# EAGLE design FinalSchematic1.1 (EAGLE 9.6.2)
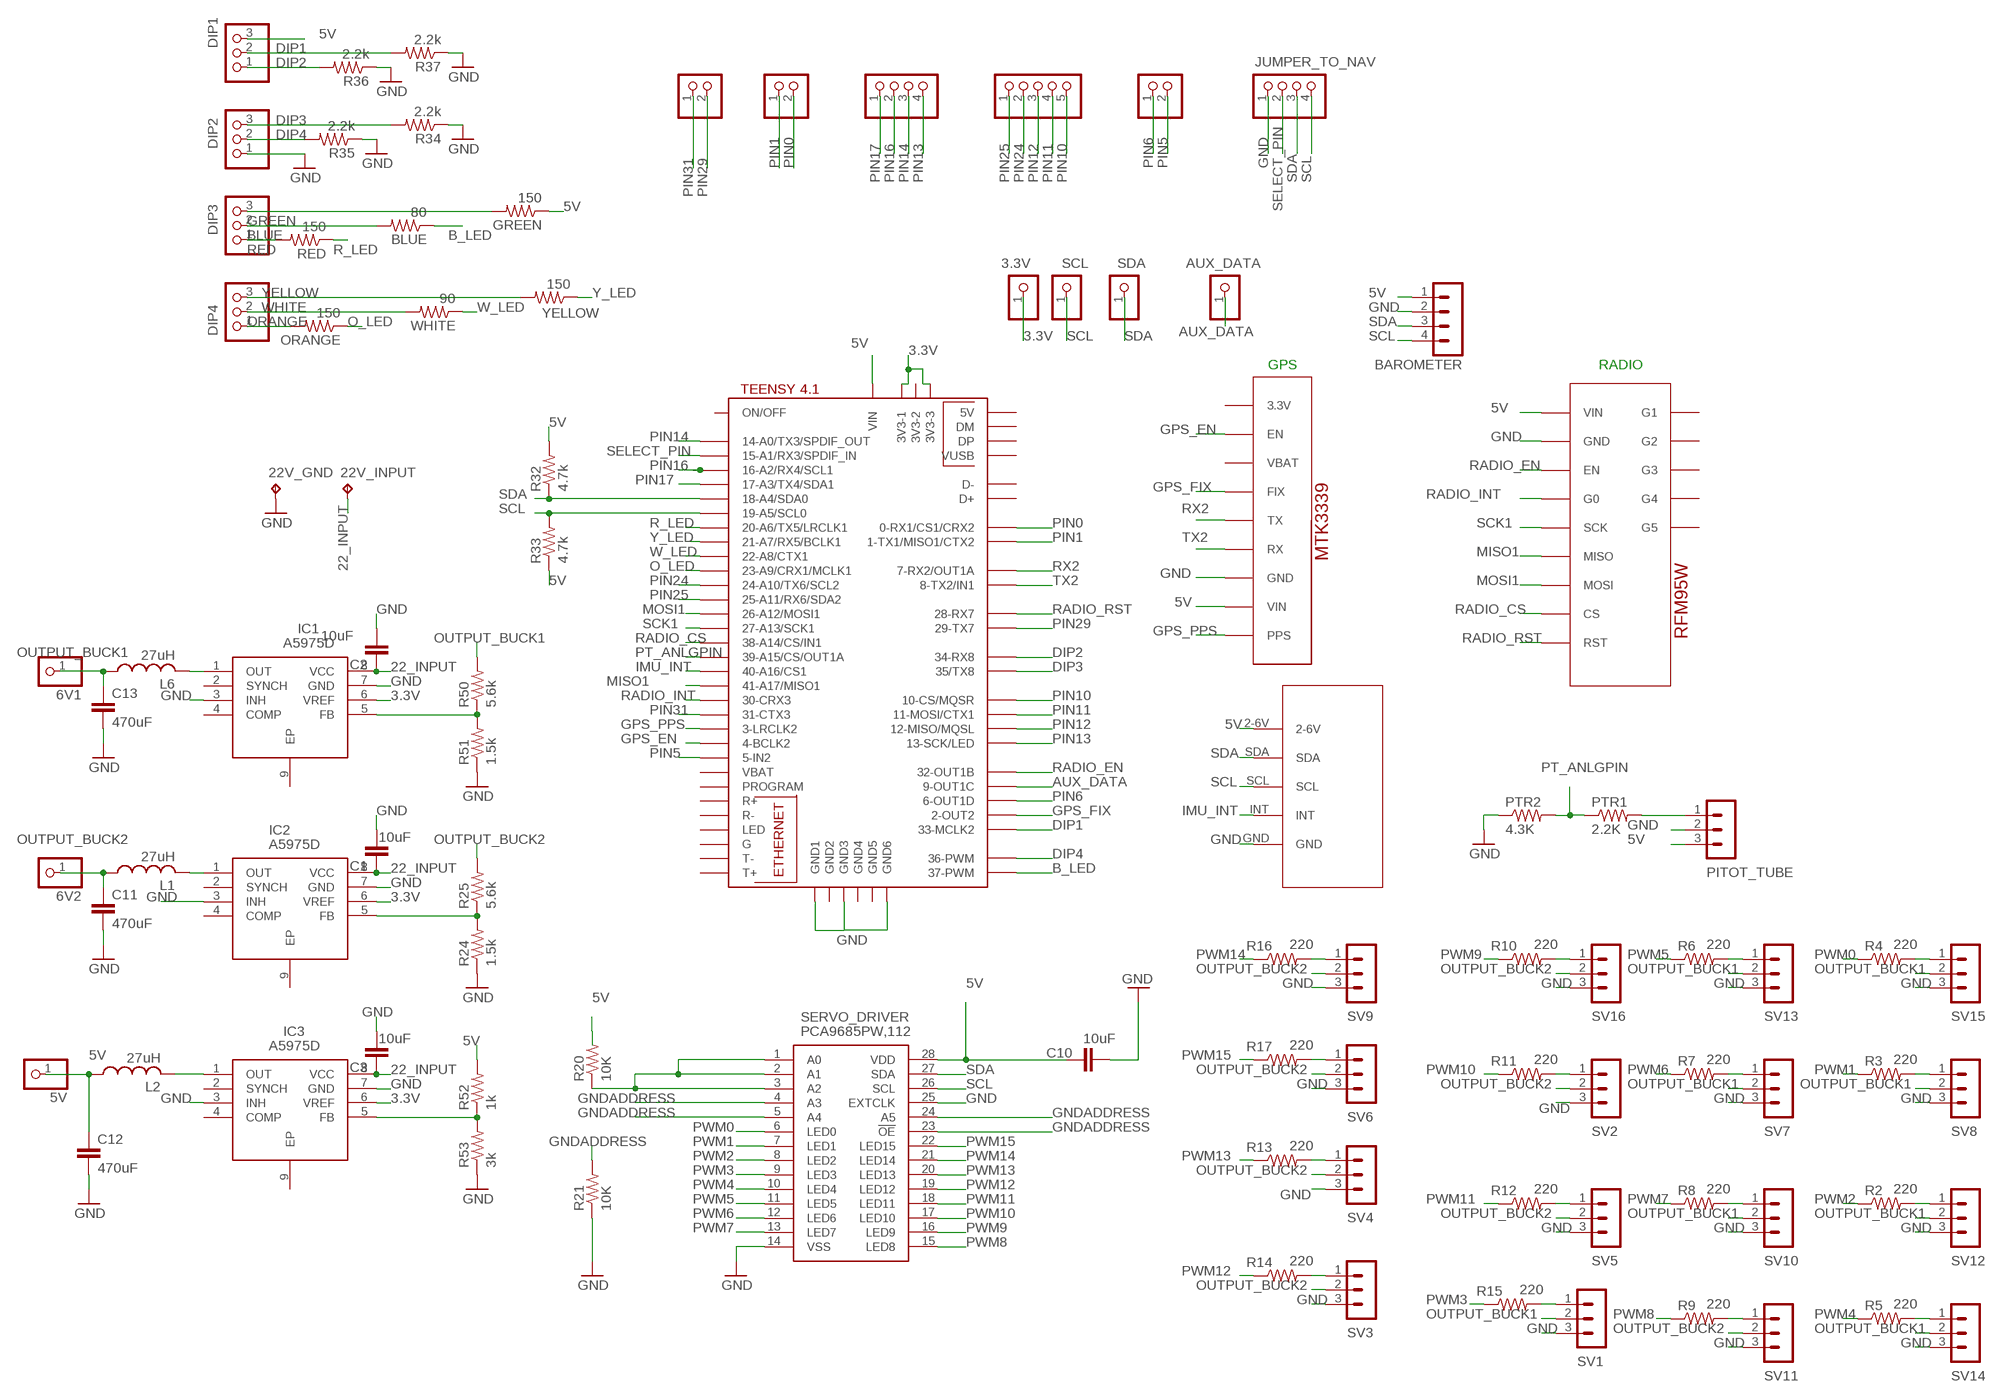
[diagram p0: schematic, sheet 1]

## Parts
1  PINHD-1X2  [1X02]
2  PINHD-1X2  [1X02]
3  PINHD-1X4  [1X04]
3.3V  PINHD-1X1  [1X01]
4  PINHD-1X5  [1X05]
5  PINHD-1X2  [1X02]
5V  PINHD-1X1  [1X01]
6V1  PINHD-1X1  [1X01]
6V2  PINHD-1X1  [1X01]
22V_GND  TPPAD1-17Y  [P1-17Y]
22V_INPUT  TPPAD1-17Y  [P1-17Y]
AUX_DATA  PINHD-1X1  [1X01]
BAROMETER  MA04-1  [MA04-1]
BLUE  80  R-US_0204/7  [0204/7]
C1  10uF  C2,5-3  [C2.5-3]
C2  10uF  C2,5-3  [C2.5-3]
C3  10uF  C2,5-3  [C2.5-3]
C10  10uF  C2,5-3  [C2.5-3]
C11  470uF  C2,5-3  [C2.5-3]
C12  470uF  C2,5-3  [C2.5-3]
C13  470uF  C2,5-3  [C2.5-3]
DIP1  PINHD-1X3  [1X03]
DIP2  PINHD-1X3  [1X03]
DIP3  PINHD-1X3  [1X03]
DIP4  PINHD-1X3  [1X03]
GPSMTK3339  ADAFRUIT_MTK3339_GPS  [ADAFRUIT_MTK3339_GPS]
GREEN  150  R-US_0204/7  [0204/7]
IC1  A5975D  [SOIC127P600X170-9N]
IC2  A5975D  [SOIC127P600X170-9N]
IC3  A5975D  [SOIC127P600X170-9N]
IMU  ICM20948BREAKOUTDEVICE  [ICM20948BREAKOUT]
JUMPER_TO_NAV  PINHD-1X4  [1X04]
L1  27uH  L-USTFI0307  [TFI0307]
L2  27uH  L-USTFI0307  [TFI0307]
L6  27uH  L-USTFI0307  [TFI0307]
ORANGE  150  R-US_0204/7  [0204/7]
PITOT_TUBE  MA03-1  [MA03-1]
PTR1  2.2K  R-US_0204/7  [0204/7]
PTR2  4.3K  R-US_0204/7  [0204/7]
R2  220  R-US_0204/7  [0204/7]
R3  220  R-US_0204/7  [0204/7]
R4  220  R-US_0204/7  [0204/7]
R5  220  R-US_0204/7  [0204/7]
R6  220  R-US_0204/7  [0204/7]
R7  220  R-US_0204/7  [0204/7]
R8  220  R-US_0204/7  [0204/7]
R9  220  R-US_0204/7  [0204/7]
R10  220  R-US_0204/7  [0204/7]
R11  220  R-US_0204/7  [0204/7]
R12  220  R-US_0204/7  [0204/7]
R13  220  R-US_0204/7  [0204/7]
R14  220  R-US_0204/7  [0204/7]
R15  220  R-US_0204/7  [0204/7]
R16  220  R-US_0204/7  [0204/7]
R17  220  R-US_0204/7  [0204/7]
R20  10K  R-US_0204/7  [0204/7]
R21  10K  R-US_0204/7  [0204/7]
R24  1.5k  R-US_0204/7  [0204/7]
R25  5.6k  R-US_0204/7  [0204/7]
R32  4.7k  R-US_0204/7  [0204/7]
R33  4.7k  R-US_0204/7  [0204/7]
R34  2.2k  R-US_0204/7  [0204/7]
R35  2.2k  R-US_0204/7  [0204/7]
R36  2.2k  R-US_0204/7  [0204/7]
R37  2.2k  R-US_0204/7  [0204/7]
R50  5.6k  R-US_0204/7  [0204/7]
R51  1.5k  R-US_0204/7  [0204/7]
R52  1k  R-US_0204/7  [0204/7]
R53  3k  R-US_0204/7  [0204/7]
RADIO  ADAFRUIT_RFM95W_LORA_RADIO  [ADAFRUIT_RFM95W_LORA_RADIO]
RED  150  R-US_0204/7  [0204/7]
SCL  PINHD-1X1  [1X01]
SDA  PINHD-1X1  [1X01]
SERVO_DRIVER  PCA9685PW,112  [SOP65P640X110-28N]
SV1  MA03-1  [MA03-1]
SV2  MA03-1  [MA03-1]
SV3  MA03-1  [MA03-1]
SV4  MA03-1  [MA03-1]
SV5  MA03-1  [MA03-1]
SV6  MA03-1  [MA03-1]
SV7  MA03-1  [MA03-1]
SV8  MA03-1  [MA03-1]
SV9  MA03-1  [MA03-1]
SV10  MA03-1  [MA03-1]
SV11  MA03-1  [MA03-1]
SV12  MA03-1  [MA03-1]
SV13  MA03-1  [MA03-1]
SV14  MA03-1  [MA03-1]
SV15  MA03-1  [MA03-1]
SV16  MA03-1  [MA03-1]
TEENSY4.1  TEENSY41  [TEENSY41]
WHITE  90  R-US_0204/7  [0204/7]
YELLOW  150  R-US_0204/7  [0204/7]

## Nets
3.3V: 3.3V.1 IC1.6(VREF) IC2.6(VREF) IC3.6(VREF) TEENSY4.1.3V3-1 TEENSY4.1.3V3-3
5V: 5V.1 BAROMETER.1 C10.1 C12.1 DIP1.3 GPSMTK3339.VIN GREEN.1 IMU.2-6V L2.1 PITOT_TUBE.3 R20.2 R32.2 R33.1 R52.2 RADIO.1(VIN) SERVO_DRIVER.28(VDD) TEENSY4.1.VIN
22_INPUT: 22V_INPUT.TP C1.1 C2.1 C3.1 IC1.8(VCC) IC2.8(VCC) IC3.8(VCC)
AUX_DATA: AUX_DATA.1 TEENSY4.1.9-OUT1C
B_LED: BLUE.1 TEENSY4.1.37-PWM
BLUE: BLUE.2 DIP3.2
DIP1: DIP1.2 R37.2 TEENSY4.1.33-MCLK2
DIP2: DIP1.1 R36.2 TEENSY4.1.34-RX8
DIP3: DIP2.3 R34.2 TEENSY4.1.35-TX8(35/TX8)
DIP4: DIP2.2 R35.2 TEENSY4.1.36-PWM
GND: 22V_GND.TP BAROMETER.2 C1.2 C2.2 C3.2 C10.2 C11.2 C12.2 C13.2 DIP2.1 GPSMTK3339.GND IC1.3(INH) IC1.7(GND) IC2.3(INH) IC2.7(GND) IC3.3(INH) IC3.7(GND) IMU.GND JUMPER_TO_NAV.1 PITOT_TUBE.2 PTR2.1 R21.1 R24.1 R34.1 R35.1 R36.1 R37.1 R51.1 R53.1 RADIO.2(GND) SERVO_DRIVER.14(VSS) SERVO_DRIVER.25(EXTCLK) SV1.3 SV2.3 SV3.3 SV4.3 SV5.3 SV6.3 SV7.3 SV8.3 SV9.3 SV10.3 SV11.3 SV12.3 SV13.3 SV14.3 SV15.3 SV16.3 TEENSY4.1.GND1 TEENSY4.1.GND3 TEENSY4.1.GND6
GNDADDRESS: R21.2 SERVO_DRIVER.4(A3) SERVO_DRIVER.5(A4) SERVO_DRIVER.23(!OE) SERVO_DRIVER.24(A5)
GPS_EN: GPSMTK3339.EN TEENSY4.1.4-BCLK2
GPS_FIX: GPSMTK3339.FIX TEENSY4.1.2-OUT2
GPS_PPS: GPSMTK3339.PPS TEENSY4.1.3-LRCLK2
GREEN: DIP3.3 GREEN.2
IMU_INT: IMU.INT TEENSY4.1.40-A16/CS1
MISO1: RADIO.6(MISO) TEENSY4.1.41-A17/MISO1
MOSI1: RADIO.7(MOSI) TEENSY4.1.26-A12/MOSI1
N$2: R14.2 SV3.1
N$4: PITOT_TUBE.1 PTR1.2
N$6: IC3.1(OUT) L2.2
N$8: IC1.1(OUT) L6.2
N$9: IC1.5(FB) R50.1 R51.2
N$12: IC2.1(OUT) L1.2
N$18: IC3.5(FB) R52.1 R53.2
N$19: IC2.5(FB) R24.2 R25.1
N$43: R10.2 SV16.1
N$74: R20.1 SERVO_DRIVER.1(A0) SERVO_DRIVER.2(A1) SERVO_DRIVER.3(A2)
N$81: R6.2 SV13.1
N$82: R4.2 SV15.1
N$85: R3.2 SV8.1
N$88: R7.2 SV7.1
N$91: R11.2 SV2.1
N$94: R15.2 SV1.1
N$97: R2.2 SV12.1
N$100: R5.2 SV14.1
N$105: R9.2 SV11.1
N$108: R8.2 SV10.1
N$109: R12.2 SV5.1
N$112: R16.2 SV9.1
N$115: R17.2 SV6.1
N$118: R13.2 SV4.1
O_LED: ORANGE.1 TEENSY4.1.23-A9/CRX1/MCLK1
ORANGE: DIP4.1 ORANGE.2
OUTPUT_BUCK1: 6V1.1 C13.1 L6.1 R50.2 SV1.2 SV7.2 SV8.2 SV10.2 SV12.2 SV13.2 SV14.2 SV15.2
OUTPUT_BUCK2: 6V2.1 C11.1 L1.1 R25.2 SV2.2 SV3.2 SV4.2 SV5.2 SV6.2 SV9.2 SV11.2 SV16.2
PIN0: 2.2 TEENSY4.1.0-RX1/CS1/CRX2
PIN1: 2.1 TEENSY4.1.1-TX1/MISO1/CTX2
PIN5: 5.2 TEENSY4.1.5-IN2
PIN6: 5.1 TEENSY4.1.6-OUT1D
PIN10: 4.5 TEENSY4.1.10-CS\MQSR(10-CS/MQSR)
PIN11: 4.4 TEENSY4.1.11-MOSI/CTX1
PIN12: 4.3 TEENSY4.1.12-MISO/MQSL
PIN13: 3.4 TEENSY4.1.13-SCK/LED
PIN14: 3.3 TEENSY4.1.14-A0/TX3/SPDIF_OUT
PIN16: 3.2 TEENSY4.1.16-A2/RX4/SCL1
PIN17: 3.1 TEENSY4.1.17-A3/TX4/SDA1
PIN24: 4.2 TEENSY4.1.24-A10/TX6/SCL2
PIN25: 4.1 TEENSY4.1.25-A11/RX6/SDA2
PIN29: 1.2 TEENSY4.1.29-TX7
PIN31: 1.1 TEENSY4.1.31-CTX3
PT_ANLGPIN: PTR1.1 PTR2.2 TEENSY4.1.39-A15/CS/OUT1A
PWM0: R4.1 SERVO_DRIVER.6(LED0)
PWM1: R3.1 SERVO_DRIVER.7(LED1)
PWM2: R2.1 SERVO_DRIVER.8(LED2)
PWM3: R15.1 SERVO_DRIVER.9(LED3)
PWM4: R5.1 SERVO_DRIVER.10(LED4)
PWM5: R6.1 SERVO_DRIVER.11(LED5)
PWM6: R7.1 SERVO_DRIVER.12(LED6)
PWM7: R8.1 SERVO_DRIVER.13(LED7)
PWM8: R9.1 SERVO_DRIVER.15(LED8)
PWM9: R10.1 SERVO_DRIVER.16(LED9)
PWM10: R11.1 SERVO_DRIVER.17(LED10)
PWM11: R12.1 SERVO_DRIVER.18(LED11)
PWM12: R14.1 SERVO_DRIVER.19(LED12)
PWM13: R13.1 SERVO_DRIVER.20(LED13)
PWM14: R16.1 SERVO_DRIVER.21(LED14)
PWM15: R17.1 SERVO_DRIVER.22(LED15)
R_LED: RED.1 TEENSY4.1.20-A6/TX5/LRCLK1
RADIO_CS: RADIO.8(CS) TEENSY4.1.38-A14/CS/IN1
RADIO_EN: RADIO.3(EN) TEENSY4.1.32-OUT1B
RADIO_INT: RADIO.4(G0) TEENSY4.1.30-CRX3
RADIO_RST: RADIO.9(RST) TEENSY4.1.28-RX7
RED: DIP3.1 RED.2
RX2: GPSMTK3339.TX TEENSY4.1.7-RX2/OUT1A
SCK1: RADIO.5(SCK) TEENSY4.1.27-A13/SCK1
SCL: BAROMETER.4 IMU.SCL JUMPER_TO_NAV.4 R33.2 SCL.1 SERVO_DRIVER.26(SCL) TEENSY4.1.19-A5/SCL0
SDA: BAROMETER.3 IMU.SDA JUMPER_TO_NAV.3 R32.1 SDA.1 SERVO_DRIVER.27(SDA) TEENSY4.1.18-A4/SDA0
SELECT_PIN: JUMPER_TO_NAV.2 TEENSY4.1.15-A1/RX3/SPDIF_IN
TX2: GPSMTK3339.RX TEENSY4.1.8-TX2/IN1
W_LED: TEENSY4.1.22-A8/CTX1 WHITE.1
WHITE: DIP4.2 WHITE.2
Y_LED: TEENSY4.1.21-A7/RX5/BCLK1 YELLOW.1
YELLOW: DIP4.3 YELLOW.2
Unconnected: GPSMTK3339.3.3V GPSMTK3339.VBAT IC1.2(SYNCH) IC1.4(COMP) IC1.9(EP) IC2.2(SYNCH) IC2.4(COMP) IC2.9(EP) IC3.2(SYNCH) IC3.4(COMP) IC3.9(EP) RADIO.10(G1) RADIO.11(G2) RADIO.12(G3) RADIO.13(G4) RADIO.14(G5) TEENSY4.1.3V3-2 TEENSY4.1.+5V(5V) TEENSY4.1.D+ TEENSY4.1.D- TEENSY4.1.DM TEENSY4.1.DP TEENSY4.1.G TEENSY4.1.GND2 TEENSY4.1.GND4 TEENSY4.1.GND5 TEENSY4.1.LED TEENSY4.1.ON/OFF TEENSY4.1.PROGRAM TEENSY4.1.R+ TEENSY4.1.R- TEENSY4.1.T+ TEENSY4.1.T- TEENSY4.1.VBAT TEENSY4.1.VUSB

## Notes on the sheet
- GPS | RADIO

## Library data of the parts
1 2 5 = pinhead:PINHD-1X2: PIN HEADER
3 JUMPER_TO_NAV = pinhead:PINHD-1X4: PIN HEADER
3.3V 5V 6V1 6V2 AUX_DATA SCL SDA = pinhead:PINHD-1X1: PIN HEADER
4 = pinhead:PINHD-1X5: PIN HEADER
22V_GND 22V_INPUT = testpad:TP: Test pad
BAROMETER = con-lstb:MA04-1: PIN HEADER; OC_FARNELL: unknown; OC_NEWARK: unknown
BLUE GREEN ORANGE PTR1 PTR2 R2-R17 R20 R21 R24 R25 R32-R37 R50-R53 RED WHITE YELLOW = adafruit:R-US_: RESISTOR, American symbol
C1-C3 C10-C13 = capacitor-wima:C: CAPACITOR naming: grid - package width
DIP1-DIP4 = pinhead:PINHD-1X3: PIN HEADER
GPSMTK3339 = AERO_Eagle_Library:ADAFRUIT_MTK3339_GPS: Adafruit's Ultimate GPS Breakout: MTK3339 https://www.adafruit.com/product/746
IC1-IC3 = A5975D:A5975D: STMICROELECTRONICS - A5975D - DC/DC Boost Regulator, Adjustable, AEC-Q100, 4V to 36V In, 1.235V to 35V/3A Out, 250 kHz, PowerSO-8 Source: Datasheet <https://www.st.com/resource/en/datasheet/a5975d.pdf>; ARROW_PART_NUMBER: A5975D; ARROW_PRICE-STOCK: https://www.arrow.com/en/products/a5975d/stmicroelectronics; DESCRIPTION: STMICROELECTRONICS - A5975D - DC/DC Boost Regulator, Adjustable, AEC-Q100, 4V to 36V In, 1.235V to 35V/3A Out, 250 kHz, PowerSO-8; HEIGHT: 1.7mm; MANUFACTURER_NAME: STMicroelectronics; MANUFACTURER_PART_NUMBER: A5975D; MOUSER_PART_NUMBER: 511-A5975D; MOUSER_PRICE-STOCK: https://www.mouser.co.uk/ProductDetail/STMicroelectronics/A5975D?qs=LYO3r17CQdO66PebjUe%2FOA%3D%3D
IMU = ICM20948 BREAKOUT:ICM20948BREAKOUTDEVICE; SPICEPREFIX: X
L1 L2 L6 = rcl:L-US: INDUCTOR, American symbol; SPICEPREFIX: L
PITOT_TUBE SV1-SV16 = con-lstb:MA03-1: PIN HEADER; OC_FARNELL: unknown; OC_NEWARK: unknown
RADIO = AERO_Eagle_Library:ADAFRUIT_RFM95W_LORA_RADIO: Adafruit's LoRa Radio: RFM95W https://www.adafruit.com/product/3072
SERVO_DRIVER = PCA9685PW_112:PCA9685PW,112: 16-channel, 12-bit PWM Fm+ I2C-bus LED controller Source: Datasheet <http://www.nxp.com/docs/en/data-sheet/PCA9685.pdf>; ARROW_PART_NUMBER: PCA9685PW,112; ARROW_PRICE-STOCK: https://www.arrow.com/en/products/pca9685pw112/nxp-semiconductors; DESCRIPTION: 16-channel, 12-bit PWM Fm+ I2C-bus LED controller; HEIGHT: 1.1mm; MANUFACTURER_NAME: NXP; MANUFACTURER_PART_NUMBER: PCA9685PW,112; MOUSER_PART_NUMBER: 771-PCA9685PW,112; MOUSER_PRICE-STOCK: https://www.mouser.co.uk/ProductDetail/NXP-Semiconductors/PCA9685PW112/?qs=6YAT8rHPFU9wZqiAeiOMZw%3D%3D
TEENSY4.1 = teensy:TEENSY41

## Board
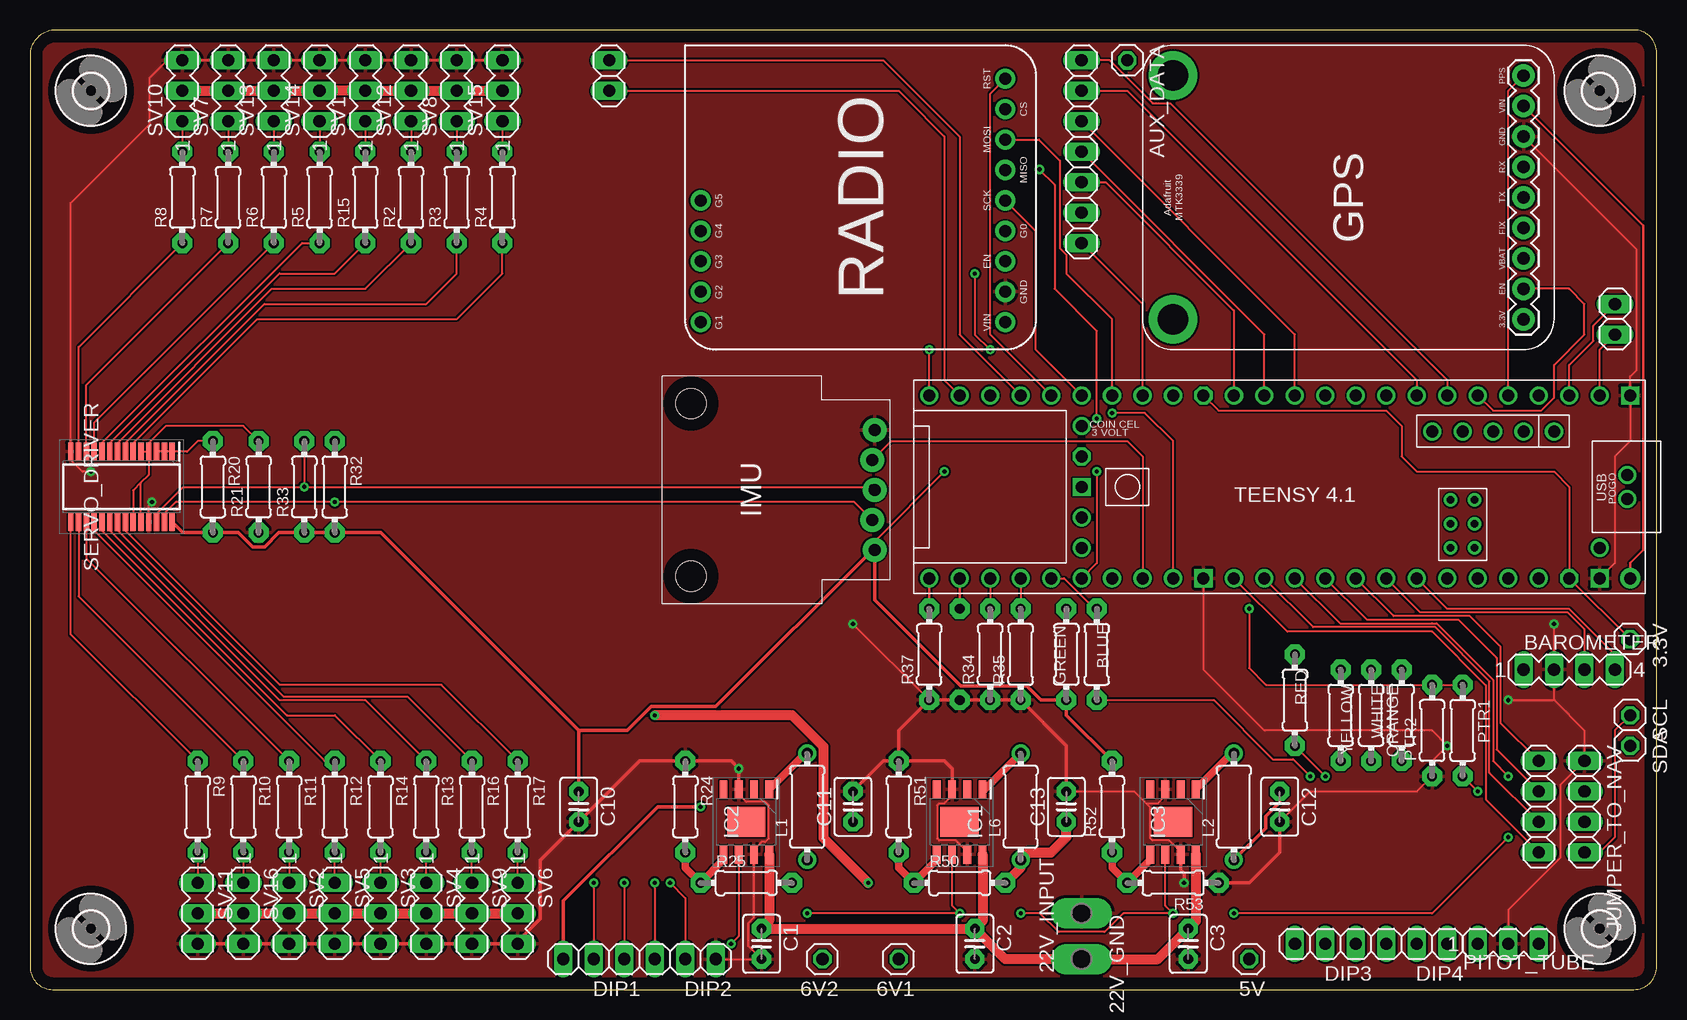
[diagram p1: board, top side]
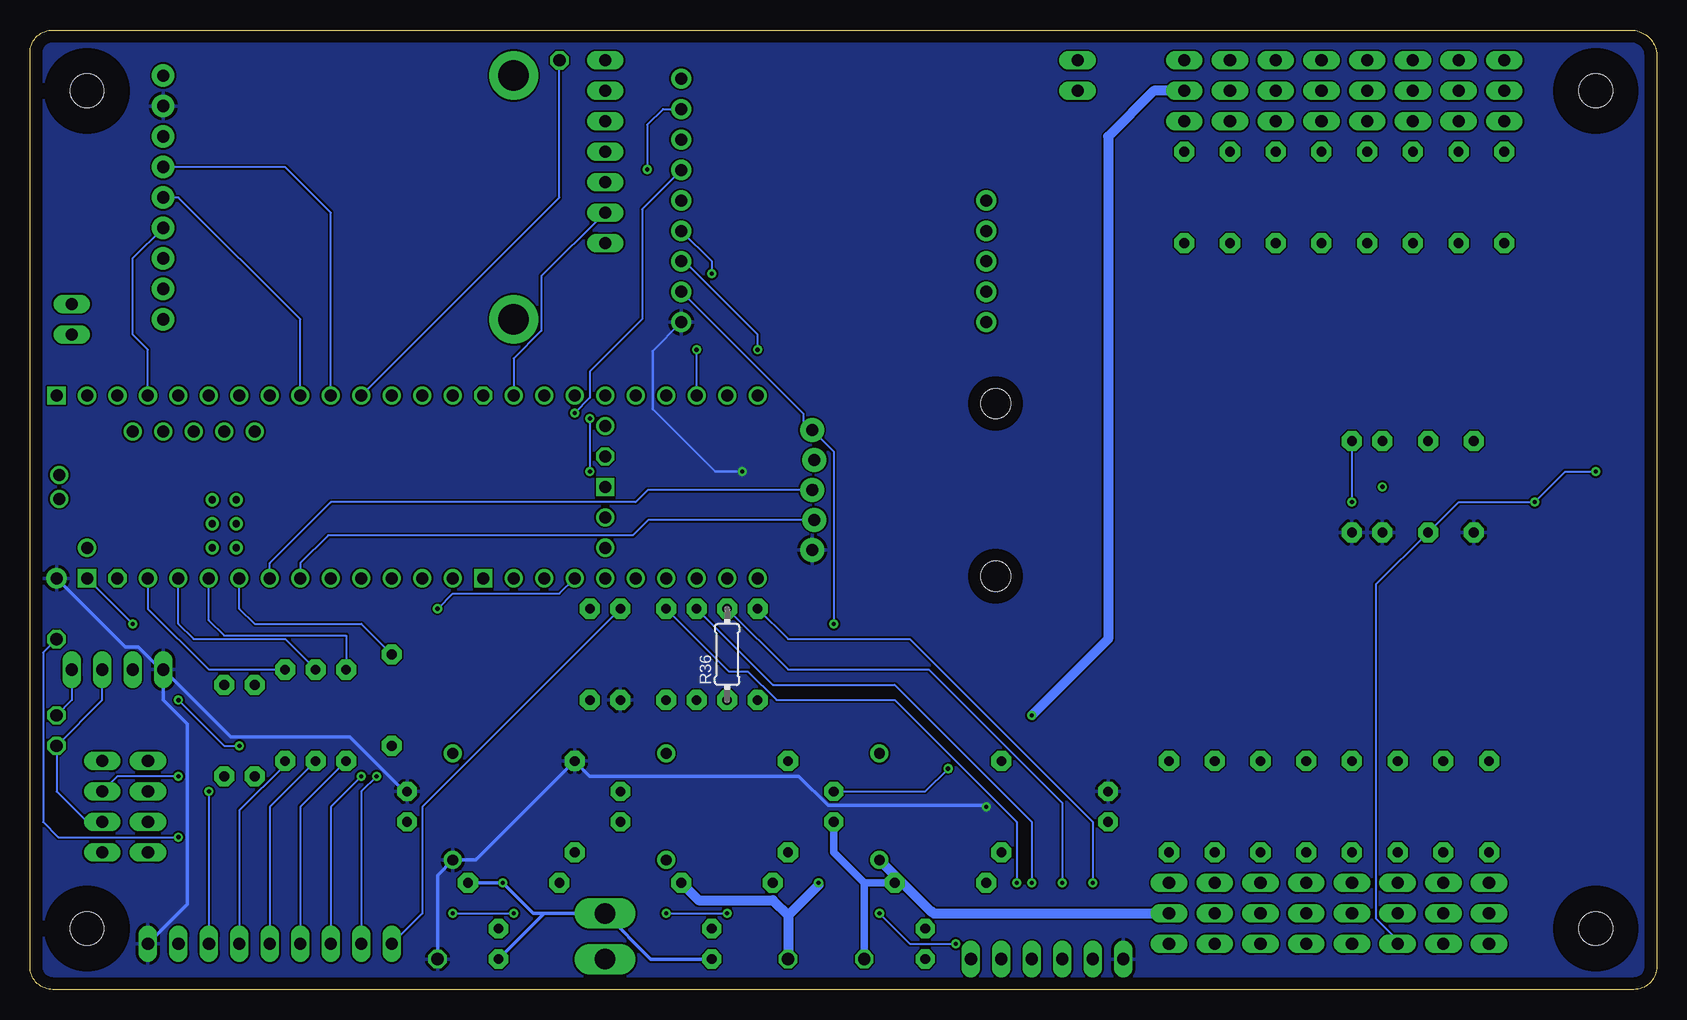
[diagram p2: board, bottom side, seen from below]

Size 135.56 x 80 mm. Coordinates in mm from the lower left corner, seen from the top.
Outline: 1.91,0 133.66,0 arc90 135.56,1.91 135.56,78.09 arc90 133.66,80 2.21,80 arc45 0.59,79.33 arc45 0,77.91 0,1.91 arc90 1.91,0
Copper layers (1*16): Top 0.035mm / dielectric 1.5mm / Bottom 0.035mm
Design rules "default *": minimum track width 6mil, minimum drill 0.35mm, track to track 6mil, track to pad 8mil, pad to pad 6mil, via to via 8mil, smd to smd 6mil, copper to edge 40mil, drill to drill 6mil, minimum pad ring 10mil, minimum via ring 8mil, stop-mask expansion 4mil, vias tented up to drill 0mil, thermal gap 10mil

### Footprints (pad centres in the part's own frame; a part is rotated, then mirrored left to right if it is on the bottom)
1X02 = drill 1.016 long: 1 -1.27,0; 2 1.27,0
1X04 = drill 1.016 long: 1 -3.81,0; 2 -1.27,0; 3 1.27,0; 4 3.81,0
1X01 = drill 1.016 octagon: 1 0,0
1X05 = drill 1.016 long: 1 -5.08,0; 2 -2.54,0; 3 0,0; 4 2.54,0; 5 5.08,0
P1-17Y = drill 1.702 pad 2.121 long: TP 0,0
MA04-1 = drill 1.016 long: 1 -3.81,0; 2 -1.27,0; 3 1.27,0; 4 3.81,0
0204/7 = drill 0.813 pad 1.676 octagon: 1 -3.81,0; 2 3.81,0
C2.5-3 = drill 0.813 pad 1.6 octagon: 1 -1.27,0; 2 1.27,0
1X03 = drill 1.016 long: 1 -2.54,0; 2 0,0; 3 2.54,0
ADAFRUIT_MTK3339_GPS = drill 1.016 pad 1.88: 3.3V 2.54,2.54; EN 5.08,2.54; FIX 10.16,2.54; GND 17.78,2.54; PPS 22.86,2.54; RX 15.24,2.54; TX 12.7,2.54; VBAT 7.62,2.54; VIN 20.32,2.54 | drill 2.54 pad 4.064: P$1 22.86,31.75; P$2 2.54,31.75
SOIC127P600X170-9N = smd 1.525 x 0.65: 1 -2.712,1.905; 2 -2.712,0.635; 3 -2.712,-0.635; 4 -2.712,-1.905; 5 2.712,-1.905; 6 2.712,-0.635; 7 2.712,0.635; 8 2.712,1.905 | smd 2.51 x 3.2: 9 0,0
ICM20948BREAKOUT = drill 1 pad 2: 2-6V -5.254,-9.427; GND 4.746,-9.427; INT 2.246,-9.227; SCL -0.254,-9.427; SDA -2.754,-9.227 | hole 2.5: -7.454,5.873; 6.946,5.873
TFI0307 = drill 0.9 pad 1.5: 1 -4.445,0; 2 4.445,0
MA03-1 = drill 1.016 long: 1 -2.54,0; 2 0,0; 3 2.54,0
ADAFRUIT_RFM95W_LORA_RADIO = drill 1 pad 1.676: 1 2.29,-26.67; 2 4.83,-26.67; 3 7.37,-26.67; 4 9.91,-26.67; 5 12.45,-26.67; 6 14.99,-26.67; 7 17.53,-26.67; 8 20.07,-26.67; 9 22.61,-26.67; 10 2.29,-1.27; 11 4.83,-1.27; 12 7.37,-1.27; 13 9.91,-1.27; 14 12.45,-1.27
SOP65P640X110-28N = smd 1.475 x 0.45: 1 -2.938,4.225; 2 -2.938,3.575; 3 -2.938,2.925; 4 -2.938,2.275; 5 -2.938,1.625; 6 -2.938,0.975; 7 -2.938,0.325; 8 -2.938,-0.325; 9 -2.938,-0.975; 10 -2.938,-1.625; 11 -2.938,-2.275; 12 -2.938,-2.925; 13 -2.938,-3.575; 14 -2.938,-4.225; 15 2.938,-4.225; 16 2.938,-3.575; 17 2.938,-2.925; 18 2.938,-2.275; 19 2.938,-1.625; 20 2.938,-0.975; 21 2.938,-0.325; 22 2.938,0.325; 23 2.938,0.975; 24 2.938,1.625; 25 2.938,2.275; 26 2.938,2.925; 27 2.938,3.575; 28 2.938,4.225
TEENSY41 = drill 1: 0-RX1/CS1/CRX2 -27.94,-7.62; 1-TX1/MISO1/CTX2 -25.4,-7.62; 2-OUT2 -22.86,-7.62; 3-LRCLK2 -20.32,-7.62; 4-BCLK2 -17.78,-7.62; 5-IN2 -15.24,-7.62; 6-OUT1D -12.7,-7.62; 7-RX2/OUT1A -10.16,-7.62; 8-TX2/IN1 -7.62,-7.62; 9-OUT1C -5.08,-7.62; 10-CS\MQSR -2.54,-7.62; 11-MOSI/CTX1 0,-7.62; 12-MISO/MQSL 2.54,-7.62; 13-SCK/LED 2.54,7.62; 14-A0/TX3/SPDIF_OUT 0,7.62; 15-A1/RX3/SPDIF_IN -2.54,7.62; 16-A2/RX4/SCL1 -5.08,7.62; 17-A3/TX4/SDA1 -7.62,7.62; 18-A4/SDA0 -10.16,7.62; 19-A5/SCL0 -12.7,7.62; 20-A6/TX5/LRCLK1 -15.24,7.62; 21-A7/RX5/BCLK1 -17.78,7.62; 22-A8/CTX1 -20.32,7.62; 23-A9/CRX1/MCLK1 -22.86,7.62; 24-A10/TX6/SCL2 7.62,-7.62; 25-A11/RX6/SDA2 10.16,-7.62; 26-A12/MOSI1 12.7,-7.62; 27-A13/SCK1 15.24,-7.62; 28-RX7 17.78,-7.62; 29-TX7 20.32,-7.62; 30-CRX3 22.86,-7.62; 31-CTX3 25.4,-7.62; 32-OUT1B 27.94,-7.62; 33-MCLK2 27.94,7.62; 34-RX8 25.4,7.62; 35-TX8 22.86,7.62; 36-PWM 20.32,7.62; 37-PWM 17.78,7.62; 38-A14/CS/IN1 15.24,7.62; 39-A15/CS/OUT1A 12.7,7.62; 40-A16/CS1 10.16,7.62; 41-A17/MISO1 7.62,7.62; +5V -24.13,-4.62; D+ -30.25,-1; D- -30.25,1; DM -21.59,-4.62; DP -19.05,-4.62; GND4 -16.51,-4.62; GND5 -13.97,-4.62; ON/OFF 15.24,5.08; PROGRAM 15.24,2.54; VBAT 15.24,-5.08; VUSB -27.94,5.08 | drill 1 octagon: 3V3-1 5.08,-7.62; 3V3-2 15.24,-2.54; 3V3-3 -25.4,7.62 | drill 0.6: G -15.51,3.08; LED -17.51,3.08; R+ -17.51,5.08; R- -15.51,5.08; T+ -15.51,1.08; T- -17.51,1.08 | drill 1 square: GND1 -30.48,-7.62; GND2 15.24,0; GND3 5.08,7.62; GND6 -27.94,7.62 | drill 1 pad 1.676: VIN -30.48,7.62
2,8 = hole 2.8: 0,0

### Placement (x,y rotation side)
1  48.26,76.2 90 top
2  132.08,55.88 270 top
3  125.73,15.24 270 top
3.3V  133.35,29.21 270 top
4  87.63,67.31 90 top
5  87.63,76.2 90 top
5V  101.6,2.54 180 top
6V1  72.39,2.54 180 top
6V2  66.04,2.54 180 top
22V_GND  87.63,6.35 270 top
22V_INPUT  87.63,2.54 90 top
AUX_DATA  91.44,77.47 270 top
BAROMETER  128.27,26.67 0 top
BLUE  88.9,27.94 270 top
C1  60.96,3.81 270 top
C2  78.74,3.81 270 top
C3  96.52,3.81 270 top
C10  45.72,15.24 270 top
C11  68.58,15.24 90 top
C12  104.14,15.24 270 top
C13  86.36,15.24 90 top
DIP1  46.99,2.54 180 top
DIP2  54.61,2.54 180 top
DIP3  107.95,3.81 180 top
DIP4  115.57,3.81 180 top
GPSMTK3339  127,53.34 90 top
GREEN  86.36,27.94 90 top
IC1  77.47,13.97 270 top
IC2  59.69,13.97 270 top
IC3  95.25,13.97 270 top
IMU  60.96,41.91 90 top
JUMPER_TO_NAV  129.54,15.24 270 top
L1  64.77,15.24 90 top
L2  100.33,15.24 90 top
L6  82.55,15.24 90 top
ORANGE  114.3,22.86 270 top
PITOT_TUBE  123.19,3.81 0 top
PTR1  119.38,21.59 270 top
PTR2  116.84,21.59 90 top
R2  31.75,66.04 90 top
R3  35.56,66.04 90 top
R4  39.37,66.04 90 top
R5  24.13,66.04 90 top
R6  20.32,66.04 90 top
R7  16.51,66.04 90 top
R8  12.7,66.04 90 top
R9  13.97,15.24 270 top
R10  17.78,15.24 270 top
R11  21.59,15.24 270 top
R12  25.4,15.24 270 top
R13  33.02,15.24 270 top
R14  29.21,15.24 270 top
R15  27.94,66.04 90 top
R16  36.83,15.24 270 top
R17  40.64,15.24 270 top
R20  15.24,41.91 270 top
R21  19.05,41.91 90 top
R24  54.61,15.24 270 top
R25  59.69,8.89 0 top
R32  25.4,41.91 270 top
R33  22.86,41.91 90 top
R34  80.01,27.94 90 top
R35  82.55,27.94 90 top
R36  77.47,27.94 90 bottom
R37  74.93,27.94 90 top
R50  77.47,8.89 0 top
R51  72.39,15.24 270 top
R52  90.17,15.24 90 top
R53  95.25,8.89 180 top
RADIO  54.61,53.34 90 top
RED  105.41,24.13 270 top
SCL  133.35,22.86 270 top
SDA  133.35,20.32 270 top
SERVO_DRIVER  7.62,41.91 270 top
SV1  27.94,74.93 90 top
SV2  21.59,6.35 270 top
SV3  29.21,6.35 270 top
SV4  33.02,6.35 270 top
SV5  25.4,6.35 270 top
SV6  40.64,6.35 270 top
SV7  16.51,74.93 90 top
SV8  35.56,74.93 90 top
SV9  36.83,6.35 270 top
SV10  12.7,74.93 90 top
SV11  13.97,6.35 270 top
SV12  31.75,74.93 90 top
SV13  20.32,74.93 90 top
SV14  24.13,74.93 90 top
SV15  39.37,74.93 90 top
SV16  17.78,6.35 270 top
TEENSY4.1  102.87,41.91 180 top
U$1  [2,8]  5.08,74.93 0 top
U$3  [2,8]  130.81,74.93 0 top
U$4  [2,8]  5.08,5.08 0 top
U$5  [2,8]  130.81,5.08 0 top
WHITE  111.76,22.86 270 top
YELLOW  109.22,22.86 270 top

### Tracks (layer width: path | path; a pad name or v marks a point on that pad's centre or on a via)
3.3V  (via drill 0.35)
  Top 0.152: 3.3V.1 TEENSY4.1.3V3-3 128.27,41.91 127,43.18 115.57,43.18 114.3,44.45 114.3,46.99 113.03,48.26 99.06,48.26 TEENSY4.1.3V3-1 | v100.33,6.35 116.84,6.35 v123.19,12.7 | IC3.6 94.62,6.99 v95.25,6.35 91.11,6.35 89.55,4.79 85.71,4.79 84.15,6.35 v82.55,6.35 | IC1.6 76.84,6.99 v77.47,6.35 v64.77,6.35 | IC2.6 59.06,4.45 v58.42,3.81
  Bottom 0.152: 3.3V.1 134.47,28.09 134.47,13.97 133.2,12.7 v123.19,12.7 | v100.33,6.35 v95.25,6.35 | v82.55,6.35 v77.47,6.35 | v64.77,6.35 62.23,3.81 v58.42,3.81
5V  (via drill 0.35)
  Top 0.203: GPSMTK3339.VIN 134.44,63.68 134.44,36.65 133.35,35.56 TEENSY4.1.VIN | 70.39,32.48 IMU.2-6V 70.39,36.83 70.39,37.37 v76.2,43.18
  Top 0.305: R52.2 86.36,22.86 GREEN.1 84.24,24.13 83.04,25.32 77.55,25.32 70.39,32.48 70.39,36.83 57.15,23.59 51.77,23.59 49.76,21.59 45.72,21.59 | C10.1 45.72,21.59 | 45.72,21.59 29.21,38.1 R32.2 R33.1 20.74,38.1 19.54,36.91 18.56,36.91 17.36,38.1 R20.2 12.72,38.1 SERVO_DRIVER.28 | DIP1.3 44.45,7.39 52.3,15.24 v55.88,15.24 | C12.1 104.14,15.6 102.98,14.45 102.98,13.45 L2.1
  Bottom 0.203: RADIO.1 83.67,53.24 83.67,48.41 78.44,43.18 v76.2,43.18
  Bottom 0.305: BAROMETER.1 124.46,24.13 122.46,22.13 122.46,7.08 PITOT_TUBE.3 | v55.88,15.24 55.99,15.35 69.06,15.35 71.48,17.78 88.9,17.78 R52.2 98.43,10.79 L2.1 101.6,9.53 5V.1 | TEENSY4.1.VIN 127.61,28.55 126.54,28.55 124.66,26.67 BAROMETER.1 | BAROMETER.1 118.84,21.05 108.92,21.05 104.37,16.51 C12.1
  pour Bottom: 1.91,80.01 133.99,80.01 arc-90 135.89,78.11 135.89,1.91 arc-90 133.99,0 1.91,0 arc-90 0,1.91 0,78.11 arc-90
22_INPUT
  Top 0.813: IC1.8 79.38,5.71 C2.1 | IC3.8 97.16,5.71 C3.1 93.98,2.54 22V_INPUT.TP 81.28,2.54 C2.1 | C2.1 C1.1 61.59,5.71 IC2.8
AUX_DATA
  Bottom 0.152: TEENSY4.1.9-OUT1C 91.44,66.04 AUX_DATA.1
B_LED
  Top 0.152: BLUE.1 88.71,31.75 86.17,34.29 TEENSY4.1.37-PWM
BLUE  (via drill 0.35)
  Top 0.152: BLUE.2 98.63,24.13 103.56,19.2 105.26,19.2 v106.68,17.78
  Bottom 0.152: v106.68,17.78 107.95,16.51 DIP3.2
DIP1  (via drill 0.35)
  Top 0.152: v46.99,8.89 DIP1.2
  Top 0.203: TEENSY4.1.33-MCLK2 R37.2
  Bottom 0.152: R37.2 72.39,29.21 62.23,29.21 46.99,13.97 v46.99,8.89
DIP2  (via drill 0.35)
  Top 0.152: v49.53,8.89 DIP1.1
  Top 0.203: TEENSY4.1.34-RX8 R36.2
  Bottom 0.152: R36.2 72.39,26.67 60.65,26.67 49.53,15.55 v49.53,8.89
DIP3  (via drill 0.35)
  Top 0.152: TEENSY4.1.35-TX8 R34.2 | v52.07,8.89 DIP2.3
  Bottom 0.152: R34.2 73.66,25.4 63.5,25.4 52.07,13.97 v52.07,8.89
DIP4  (via drill 0.35)
  Top 0.152: TEENSY4.1.36-PWM R35.2 | v53.34,8.89 54.61,7.62 DIP2.2
  Bottom 0.152: R35.2 77.32,26.52 75.74,26.52 73.35,24.13 63.5,24.13 53.34,13.97 v53.34,8.89
GND  (via drill 0.35)
  Top 0.152: v127,30.48 BAROMETER.2 127,24.13 | v123.19,24.13 127,24.13 | GPSMTK3339.GND 133.88,61.7 133.88,51.64 133.35,51.1 TEENSY4.1.GND1 133.35,45.72 132.08,44.45 132.08,35.56 TEENSY4.1.GND6 | 127,24.13 129.54,21.59 JUMPER_TO_NAV.1 127.53,17.04 127.53,11 123.19,6.66 PITOT_TUBE.2 | SERVO_DRIVER.25 9.9,40.38 v10.16,40.64 | v5.08,43.18 4.36,43.18 3.4,44.14 SERVO_DRIVER.14 3.4,65.57 9.98,72.16 9.98,76.02 11.43,77.47 SV10.3 | IC2.3 59.06,16.27 59.69,15.64 61.27,15.64 61.57,15.34 61.57,12.6 61.27,12.3 60.96,12.3 60.33,11.66 IC2.7 | IC1.7 78.21,11.36 77.14,12.44 75.75,12.44 75.59,12.6 75.59,15.34 75.75,15.5 76.2,15.5 76.84,16.14 IC1.3 | C13.2 92.03,16.51 93.04,15.5 | 93.04,15.5 93.98,15.5 94.62,16.14 IC3.3 | 93.04,15.5 93.37,15.17 93.37,12.6 93.53,12.44 94.92,12.44 95.89,11.47 IC3.7 | TEENSY4.1.GND3 97.79,26.67 102.87,21.59 116.84,21.59 v118.11,20.32 116.84,19.05 PTR2.1 115.57,16.51 106.68,16.51 C12.2 | DIP2.1 C1.2 | R37.1 v68.58,30.48
  Top 0.203: SV10.3 SV7.3 SV13.3 SV14.3 SV1.3 SV12.3 SV8.3 SV15.3 | IC2.7 60.33,6.01 59.86,5.54 59.86,3.65 C1.2
  Top 0.305: C11.2 71.12,19.05 R51.1 | R51.1 72.39,21.59 R37.1 R36.1 R34.1 R35.1 86.36,20.32 C13.2 | SV11.3 SV16.3 SV2.3 SV5.3 SV3.3 SV4.3 SV9.3 SV6.3 40.64,4.01 42.52,5.89 42.52,10.77 C10.2 50.8,19.05 R24.1 58.42,19.05 v59.06,18.41 IC2.3 | v96.17,8.89 96.17,9.71 95.89,9.99 IC3.7 | R53.1 101.6,8.89 104.14,11.43 C12.2 | R51.1 76.2,19.05 76.84,18.41 IC1.3
  Bottom 0.152: TEENSY4.1.GND6 v127,30.48 | RADIO.2 71.12,48.01 71.12,47.39 IMU.GND 68.58,44.85 v68.58,30.48 | v5.08,43.18 7.62,43.18 v10.16,40.64 16.51,40.64 R21.1 23.39,33.76 23.39,5.92 21.59,4.12 SV2.3 | C11.2 60.96,16.51 v59.06,18.41 | v123.19,24.13 119.38,20.32 v118.11,20.32
  Bottom 0.305: R53.1 v96.17,8.89 93.63,6.35 92.71,6.35 | C2.2 83.82,2.54 22V_GND.TP 92.71,6.35 | 92.71,6.35 C3.2
  pour Top: 1.91,80.01 133.99,80.01 arc-90 135.89,78.11 135.89,1.91 arc-90 133.99,0 1.91,0 arc-90 0,1.91 0,78.11 arc-90
GNDADDRESS
  Top 0.152: SERVO_DRIVER.5 SERVO_DRIVER.4 | SERVO_DRIVER.4 9.9,42.91 9.25,42.27 | SERVO_DRIVER.23 8.6,41.62 9.25,42.27 | SERVO_DRIVER.24 9.25,42.27 | R21.2 17.78,46.99 11.33,46.99 9.9,45.56 SERVO_DRIVER.4
GPS_EN
  Top 0.152: TEENSY4.1.4-BCLK2 121.92,48.26 125.92,48.26 127,49.34 127,52.07 129.54,54.61 129.54,57.15 128.27,58.42 GPSMTK3339.EN
GPS_FIX
  Bottom 0.152: GPSMTK3339.FIX 127,60.96 127,54.61 125.73,53.34 TEENSY4.1.2-OUT2
GPS_PPS
  Top 0.152: TEENSY4.1.3-LRCLK2 123.19,74.93 GPSMTK3339.PPS
GREEN
  Bottom 0.152: GREEN.2 102.87,15.24 102.87,6.35 DIP3.3
IMU_INT
  Top 0.152: IMU.INT 71.75,45.72 91.44,45.72 92.71,44.45 TEENSY4.1.40-A16/CS1
MISO1  (via drill 0.35)
  Top 0.152: TEENSY4.1.41-A17/MISO1 95.25,45.72 92.9,48.07 v90.17,48.07
  Bottom 0.152: RADIO.6 84.56,65.05 84.56,55.88 88.9,51.54 88.9,49.34 v90.17,48.07
MOSI1
  Top 0.152: TEENSY4.1.26-A12/MOSI1 90.17,55.88 86.36,59.69 86.36,61.27 85.83,61.8 85.83,69.11 84.07,70.87 RADIO.7
N$2
  Top 0.152: SV3.1 R14.2
N$4  (via drill 0.35)
  Top 0.152: PTR1.2 v120.65,16.51
  Bottom 0.152: v120.65,16.51 PITOT_TUBE.1
N$6
  Top 0.61: IC3.1 100.16,19.68 L2.2
N$8
  Top 0.61: L6.2 79.55,16.68 IC1.1
N$9
  Top 0.61: R51.2 72.39,10.16 R50.1 75.56,10.79 IC1.5
N$12
  Top 0.61: IC2.1 64.6,19.68 L1.2
N$18
  Top 0.61: IC3.5 93.34,10.79 R53.2 90.17,10.16 R52.1
N$19
  Top 0.61: R24.2 54.61,10.16 R25.1 57.79,10.79 IC2.5
N$43
  Top 0.152: R10.2 SV16.1
N$74
  Top 0.152: R20.1 13.97,45.72 13.1,44.85 SERVO_DRIVER.1 SERVO_DRIVER.2 SERVO_DRIVER.3
N$81
  Top 0.152: SV13.1 R6.2
N$82
  Top 0.152: SV15.1 R4.2
N$85
  Top 0.152: SV8.1 R3.2
N$88
  Top 0.152: SV7.1 R7.2
N$91
  Top 0.152: R11.2 SV2.1
N$94
  Top 0.152: SV1.1 R15.2
N$97
  Top 0.152: SV12.1 R2.2
N$100
  Top 0.152: SV14.1 R5.2
N$105
  Top 0.152: R9.2 SV11.1
N$108
  Top 0.152: SV10.1 R8.2
N$109
  Top 0.152: SV5.1 R12.2
N$112
  Top 0.152: SV9.1 R16.2
N$115
  Top 0.152: SV6.1 R17.2
N$118
  Top 0.152: SV4.1 R13.2
O_LED
  Bottom 0.152: TEENSY4.1.23-A9/CRX1/MCLK1 125.73,31.75 120.65,26.67 ORANGE.1
ORANGE
  Bottom 0.152: ORANGE.2 114.3,18.74 118.11,14.93 DIP4.1
OUTPUT_BUCK1  (via drill 0.35)
  Top 0.813: SV10.2 SV7.2 SV13.2 SV14.2 SV1.2 SV12.2 SV8.2 SV15.2 | R50.2 82.55,10.16 L6.1 83.19,11.43 85.09,11.43 86.36,12.7 C13.1 | v69.85,8.89 66.13,12.61 66.13,20.25 63.52,22.86 v52.07,22.86
  Bottom 0.813: R50.2 79.83,7.44 73.66,7.44 72.39,6.17 | 72.39,6.17 6V1.1 | 72.39,6.17 69.85,8.71 v69.85,8.89 | SV15.2 41.91,74.93 45.72,71.12 45.72,29.21 v52.07,22.86
OUTPUT_BUCK2
  Top 0.813: SV11.2 SV16.2 SV2.2 SV5.2 SV3.2 SV4.2 SV9.2 SV6.2
  Bottom 0.61: R25.2 66.04,8.89 | 66.04,8.89 68.58,11.43 C11.1 | 66.04,8.89 6V2.1
  Bottom 0.813: SV6.2 60.24,6.35 60.38,6.49 60.47,6.49 L1.1 63.5,9.53 R25.2
PIN0
  Top 0.152: TEENSY4.1.0-RX1/CS1/CRX2 130.81,53.34 2.2
PIN1
  Top 0.152: TEENSY4.1.1-TX1/MISO1/CTX2 128.27,52.07 130.28,54.08 130.28,55.35 2.1
PIN5
  Top 0.152: TEENSY4.1.5-IN2 118.11,50.8 95.02,73.89 93.55,73.89 89.97,77.47 5.2
PIN6
  Top 0.152: 5.1 91.44,74.93 115.57,50.8 TEENSY4.1.6-OUT1D
PIN10
  Top 0.152: 4.5 105.41,54.61 TEENSY4.1.10-CS\MQSR
PIN11
  Top 0.152: TEENSY4.1.11-MOSI/CTX1 102.87,54.61 4.4
PIN12
  Top 0.152: TEENSY4.1.12-MISO/MQSL 100.33,56.61 89.63,67.31 4.3
PIN13
  Top 0.152: TEENSY4.1.13-SCK/LED 104.78,29.84 116.84,29.84 121.31,25.37 121.31,15.85 3.4
PIN14
  Top 0.152: TEENSY4.1.14-A0/TX3/SPDIF_OUT 106.93,30.23 117.09,30.23 121.62,25.7 121.62,18.08 3.3
PIN16
  Top 0.152: TEENSY4.1.16-A2/RX4/SCL1 111.4,30.84 119.02,30.84 122.23,27.63 122.23,20.01 3.2
PIN17
  Top 0.152: TEENSY4.1.17-A3/TX4/SDA1 113.64,31.14 119.99,31.14 122.53,28.6 122.53,22.25 3.1
PIN24
  Bottom 0.152: 4.2 92.94,59.46 92.94,54.92 95.25,52.61 TEENSY4.1.24-A10/TX6/SCL2
PIN25
  Top 0.152: TEENSY4.1.25-A11/RX6/SDA2 92.71,57.15 4.1
PIN29
  Top 0.152: TEENSY4.1.29-TX7 77.47,54.61 77.47,71.12 71.12,77.47 1.2
PIN31
  Top 0.152: TEENSY4.1.31-CTX3 76.2,50.8 76.2,71.12 73.03,74.3 72.92,74.4 72.39,74.93 1.1
PT_ANLGPIN  (via drill 0.35)
  Top 0.152: v101.6,31.75 101.6,26.8 103,25.4 PTR2.2 PTR1.1
  Bottom 0.152: v101.6,31.75 100.33,33.02 91.44,33.02 TEENSY4.1.39-A15/CS/OUT1A
PWM0
  Top 0.152: SERVO_DRIVER.6 8.6,45.56 18.92,55.88 35.56,55.88 39.37,59.69 R4.1
PWM1
  Top 0.152: SERVO_DRIVER.7 7.95,45.56 19.54,57.15 33.02,57.15 35.56,59.69 R3.1
PWM2
  Top 0.152: SERVO_DRIVER.8 7.3,45.56 20.16,58.42 27.94,58.42 R2.1
PWM3
  Top 0.152: SERVO_DRIVER.9 6.65,45.56 20.78,59.69 25.4,59.69 R15.1
PWM4
  Top 0.152: SERVO_DRIVER.10 6,45.56 22.67,62.23 R5.1
PWM5
  Top 0.152: SERVO_DRIVER.11 5.35,47.26 R6.1
PWM6
  Top 0.152: SERVO_DRIVER.12 4.7,50.41 R7.1
PWM7
  Top 0.152: SERVO_DRIVER.13 4.05,53.58 R8.1
PWM8
  Top 0.152: R9.1 3.4,29.62 SERVO_DRIVER.15
PWM9
  Top 0.152: SERVO_DRIVER.16 4.05,32.78 R10.1
PWM10
  Top 0.152: R11.1 4.7,35.95 SERVO_DRIVER.17
PWM11
  Top 0.152: SERVO_DRIVER.18 5.35,38.26 24.56,19.05 R12.1
PWM12
  Top 0.152: SERVO_DRIVER.19 6,38.26 21.4,22.86 25.4,22.86 R14.1
PWM13
  Top 0.152: SERVO_DRIVER.20 6.65,38.26 20.78,24.13 27.94,24.13 R13.1
PWM14
  Top 0.152: SERVO_DRIVER.21 7.3,38.26 21.12,24.43 31.45,24.43 R16.1
PWM15
  Top 0.152: SERVO_DRIVER.22 7.95,38.26 20.81,25.4 34.29,25.4 R17.1
R_LED
  Bottom 0.152: TEENSY4.1.20-A6/TX5/LRCLK1 118.11,31.75 116.84,30.48 107.95,30.48 RED.1
RADIO_CS  (via drill 0.35)
  Top 0.152: v88.9,43.18 88.9,35.56 TEENSY4.1.38-A14/CS/IN1 | v84.12,68.37 85.4,67.1 85.4,58.42 88.9,54.91 v88.9,47.6
  Bottom 0.152: v88.9,47.6 v88.9,43.18 | RADIO.8 82.8,73.41 84.12,72.08 v84.12,68.37
RADIO_EN  (via drill 0.35)
  Top 0.152: TEENSY4.1.32-OUT1B v74.93,53.34
  Bottom 0.152: v74.93,53.34 74.93,54.61 81.03,60.71 RADIO.3
RADIO_INT  (via drill 0.35)
  Top 0.152: v78.74,59.69 78.74,54.61 v80.01,53.34
  Bottom 0.152: TEENSY4.1.30-CRX3 v80.01,53.34 | RADIO.4 78.74,60.71 v78.74,59.69
RADIO_RST
  Top 0.152: TEENSY4.1.28-RX7 80.01,54.61 80.01,74.68 80.14,74.81 RADIO.9
RED  (via drill 0.35)
  Top 0.152: RED.2 v107.95,17.78
  Bottom 0.152: v107.95,17.78 110.49,15.24 DIP3.1
RX2
  Bottom 0.152: TEENSY4.1.7-RX2/OUT1A 113.03,55.88 123.19,66.04 GPSMTK3339.TX
SCK1
  Top 0.152: RADIO.5 83.82,63.25 83.82,53.34 TEENSY4.1.27-A13/SCK1
SCL  (via drill 0.35)
  Top 0.152: BAROMETER.4 132.08,27.94 128.27,31.75 118.11,31.75 TEENSY4.1.19-A5/SCL0 | SCL.1 132.08,21.59 132.08,12.7 130.81,11.43 JUMPER_TO_NAV.4 | SERVO_DRIVER.26 10.55,39.68 12.78,41.91 v22.86,41.91 | R33.2 v22.86,41.91 | IMU.SCL v70.13,41.91 v22.86,41.91
  Bottom 0.152: TEENSY4.1.19-A5/SCL0 115.57,35.56 110.49,40.64 85.09,40.64 84.07,41.66 IMU.SCL | BAROMETER.4 132.08,24.13 SCL.1
SDA  (via drill 0.35)
  Top 0.152: TEENSY4.1.18-A4/SDA0 115.88,31.45 128.14,31.45 129.54,30.05 BAROMETER.3 | SERVO_DRIVER.27 11.2,39.68 12.16,40.64 v25.4,40.64 68.7,40.64 IMU.SDA
  Bottom 0.152: TEENSY4.1.18-A4/SDA0 113.03,35.56 110.73,37.86 85.33,37.86 84.03,39.16 IMU.SDA | BAROMETER.3 129.54,24.13 SDA.1 133.35,16.51 130.81,13.97 JUMPER_TO_NAV.3 | R32.1 v25.4,40.64
SELECT_PIN  (via drill 0.35)
  Top 0.152: TEENSY4.1.15-A1/RX3/SPDIF_IN 109.17,30.53 116.84,30.53 117.22,30.53 121.92,25.83 121.92,19.05 v123.19,17.78
  Bottom 0.152: v123.19,17.78 128.27,17.78 JUMPER_TO_NAV.2
TX2
  Bottom 0.152: TEENSY4.1.8-TX2/IN1 110.49,64.77 114.3,68.58 GPSMTK3339.RX
W_LED
  Bottom 0.152: TEENSY4.1.22-A8/CTX1 123.19,30.48 121.92,29.21 114.3,29.21 WHITE.1
WHITE
  Bottom 0.152: WHITE.2 115.57,15.24 DIP4.2
Y_LED
  Bottom 0.152: TEENSY4.1.21-A7/RX5/BCLK1 120.65,30.79 119.38,29.52 109.22,29.52 YELLOW.1
YELLOW
  Bottom 0.152: YELLOW.2 113.03,15.24 DIP4.3